# Altium schematic sheet [03] POWER.SchDoc: Template
size A4; Author: Hom; CompanyName: KitSprout; DrawnBy: Hom; Engineer: Hom; Organization: KitSprout; Revision: A; SheetNumber: 3; SheetTotal: 6; Version: 0.0; LibVersion: 0.0
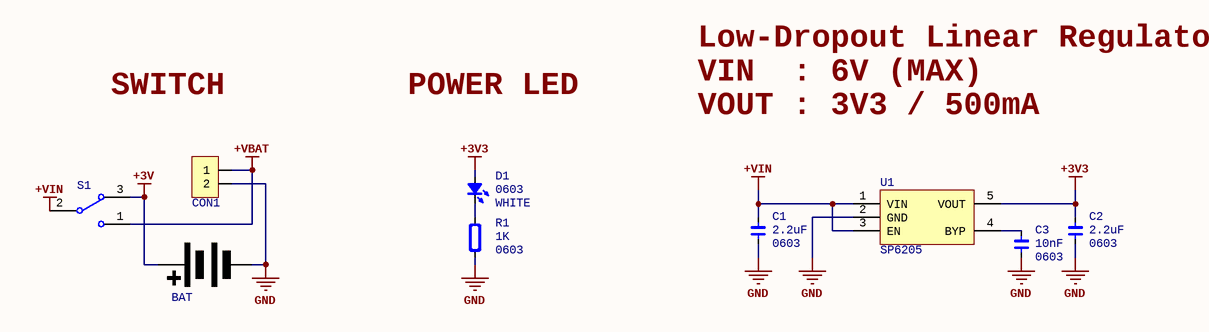
[diagram p0: [03] POWER.SchDoc]

## Parts
BAT  Battery  [CR2032-1]  (value not drawn)
C1  Type: 0603  [CAP_0603]  (hidden comment: 2.2uF)
C2  Type: 0603  [CAP_0603]  (hidden comment: 2.2uF)
C3  Type: 0603  [CAP_0603]  (hidden comment: 10nF)
CON1  MX1.25_2P  [MX1.25_S90_2P]  (value not drawn)
D1  Type: 0603  [LED_0603_YELLOW]  (hidden comment: WHITE)
R1  Type: 0603  [RES_0603]  (hidden comment: 1K)
S1  SPDT 3P  [SwitchSPDT_2.8X6.6_90]  (value not drawn)
U1  SP6205  [SOT23-5]

## Nets
+3V: BAT.2(+) S1.3
+3V3: C2.2 D1.1(A) U1.5(VOUT)
+VBAT: CON1.1 S1.1
+VIN: C1.2 S1.2 U1.1(VIN) U1.3(EN)
GND: BAT.1(-) C1.1 C2.1 C3.1 CON1.2 R1.1 U1.2(GND)
NetC3_2: C3.2 U1.4(BYP)
NetD1_2: D1.2(K) R1.2

## Notes on the sheet
- Low-Dropout Linear Regulator
- SWITCH
- POWER LED
- VIN  : 6V (MAX)
- VOUT : 3V3 / 500mA

## Library data of the parts
C1-C3 = Cap_0603: Capacitor
  C1 C2: Value: 2.2uF
  C3: Value: 10nF
CON1 = MX1.25_2P: MX
D1 = LED_0603: LED; Value: WHITE
R1 = Res_0603: Resistor; Value: 1K
S1 = SwitchSPDT_2.8x6.6_90: Switch; Value: SPDT 3P; Type: SPDT
U1 = SP6205: Power; Type: SOT23-5